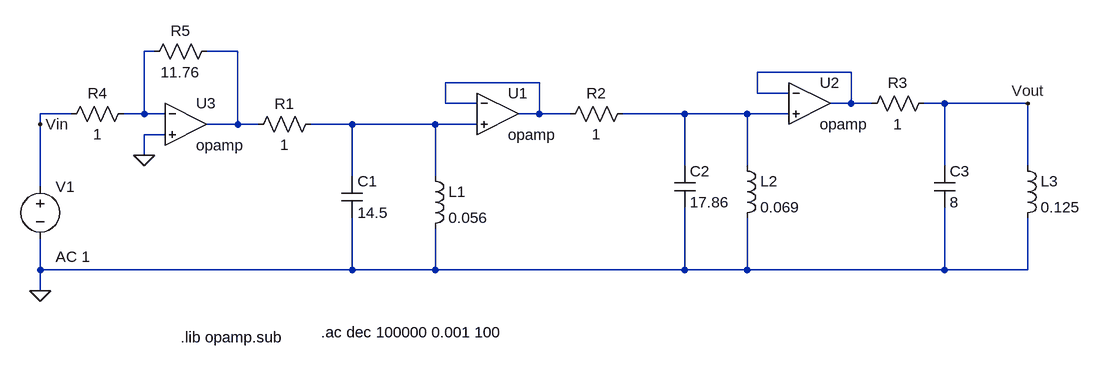
[diagram p0: schematic ejercicio4.asc]
ejercicio4.asc, the LTspice schematic file:
Version 4
SHEET 1 1244 680
WIRE -576 -160 -592 -160
WIRE -448 -160 -496 -160
WIRE 496 -128 352 -128
WIRE 16 -112 -128 -112
WIRE 352 -96 352 -128
WIRE 400 -96 352 -96
WIRE -128 -80 -128 -112
WIRE -80 -80 -128 -80
WIRE 496 -80 496 -128
WIRE 496 -80 464 -80
WIRE 528 -80 496 -80
WIRE 640 -80 608 -80
WIRE 768 -80 640 -80
WIRE -704 -64 -752 -64
WIRE -592 -64 -592 -160
WIRE -592 -64 -624 -64
WIRE -560 -64 -592 -64
WIRE 16 -64 16 -112
WIRE 16 -64 -16 -64
WIRE 64 -64 16 -64
WIRE 240 -64 144 -64
WIRE 336 -64 240 -64
WIRE 400 -64 336 -64
WIRE -752 -48 -752 -64
WIRE -448 -48 -448 -160
WIRE -448 -48 -496 -48
WIRE -416 -48 -448 -48
WIRE -272 -48 -336 -48
WIRE -144 -48 -272 -48
WIRE -80 -48 -144 -48
WIRE -560 -32 -592 -32
WIRE -592 0 -592 -32
WIRE 240 16 240 -64
WIRE 336 16 336 -64
WIRE 640 16 640 -80
WIRE 768 16 768 -80
WIRE -272 32 -272 -48
WIRE -144 32 -144 -48
WIRE -752 48 -752 -48
WIRE -752 176 -752 128
WIRE -272 176 -272 96
WIRE -272 176 -752 176
WIRE -144 176 -144 112
WIRE -144 176 -272 176
WIRE 240 176 240 80
WIRE 240 176 -144 176
WIRE 336 176 336 96
WIRE 336 176 240 176
WIRE 640 176 640 80
WIRE 640 176 336 176
WIRE 768 176 768 96
WIRE 768 176 640 176
WIRE -752 208 -752 176
FLAG -752 208 0
FLAG -752 -48 Vin
FLAG 768 -80 Vout
FLAG -592 0 0
SYMBOL voltage -752 32 R0
WINDOW 123 24 124 Left 2
WINDOW 39 0 0 Left 0
SYMATTR Value2 AC 1
SYMATTR InstName V1
SYMATTR Value ""
SYMBOL res -320 -64 R90
WINDOW 0 0 56 VBottom 2
WINDOW 3 32 56 VTop 2
SYMATTR InstName R1
SYMATTR Value 1
SYMBOL cap -288 32 R0
SYMATTR InstName C1
SYMATTR Value 14.5
SYMBOL ind -160 16 R0
SYMATTR InstName L1
SYMATTR Value 0.056
SYMBOL res 160 -80 R90
WINDOW 0 0 56 VBottom 2
WINDOW 3 32 56 VTop 2
SYMATTR InstName R2
SYMATTR Value 1
SYMBOL cap 224 16 R0
SYMATTR InstName C2
SYMATTR Value 17.86
SYMBOL ind 320 0 R0
SYMATTR InstName L2
SYMATTR Value 0.069
SYMBOL res 624 -96 R90
WINDOW 0 0 56 VBottom 2
WINDOW 3 32 56 VTop 2
SYMATTR InstName R3
SYMATTR Value 1
SYMBOL cap 624 16 R0
SYMATTR InstName C3
SYMATTR Value 8
SYMBOL ind 752 0 R0
SYMATTR InstName L3
SYMATTR Value 0.125
SYMBOL OpAmps\\opamp -48 -128 R0
SYMATTR InstName U1
SYMBOL OpAmps\\opamp 432 -144 R0
SYMATTR InstName U2
SYMBOL OpAmps\\opamp -528 -112 R0
SYMATTR InstName U3
SYMBOL res -608 -80 R90
WINDOW 0 0 56 VBottom 2
WINDOW 3 32 56 VTop 2
SYMATTR InstName R4
SYMATTR Value 1
SYMBOL res -480 -176 R90
WINDOW 0 0 56 VBottom 2
WINDOW 3 32 56 VTop 2
SYMATTR InstName R5
SYMATTR Value 11.76
TEXT -320 272 Left 2 !.ac dec 100000 0.001 100
TEXT -536 280 Left 2 !.lib opamp.sub

The netlist it stands for:
* ejercicio4.asc
V1 Vin 0 AC 1
R1 N006 N002 1
C1 N006 0 14.5
L1 N006 0 0.056
R2 N005 N004 1
C2 N005 0 17.86
L2 N005 0 0.069
R3 Vout N003 1
C3 Vout 0 8
L3 Vout 0 0.125
XU1 N004 N006 N004 opamp Aol=100K GBW=10Meg  ; pins invin noninvin out
XU2 N003 N005 N003 opamp Aol=100K GBW=10Meg  ; pins invin noninvin out
XU3 N001 0 N002 opamp Aol=100K GBW=10Meg  ; pins invin noninvin out
R4 N001 Vin 1
R5 N002 N001 11.76
.ac dec 100000 0.001 100
.lib opamp.sub
.backanno
.end